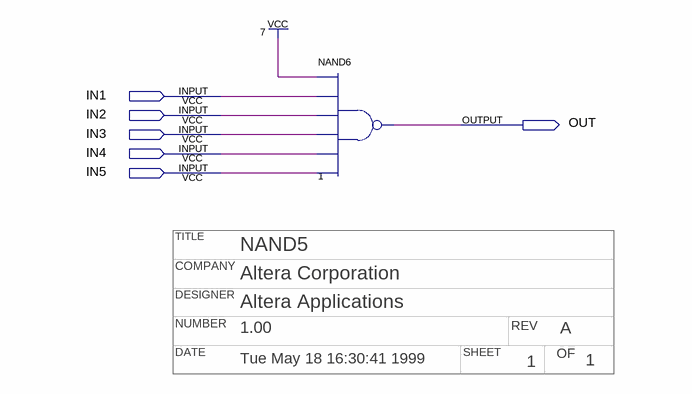
[diagram p0: schematic sheet]
// Quartus schematic nand5.bdf as structural Verilog: 1 symbols, 6 pins
// Title block: TITLE: NAND5; COMPANY: Altera Corporation; DESIGNER: Altera Applications; NUMBER: 1.00; REV: A; DATE: Tue May 18 16:30:41 1999; SHEET: 1; OF: 1
module nand5 (
  input  IN1,
  input  IN2,
  input  IN3,
  input  IN4,
  input  IN5,
  output OUT
);

  nand u_1 (OUT, 1'b1, IN1, IN2, IN3, IN4, IN5);
endmodule
